# EAGLE board 6matrix (EAGLE 9.4.1), part 1 of 2
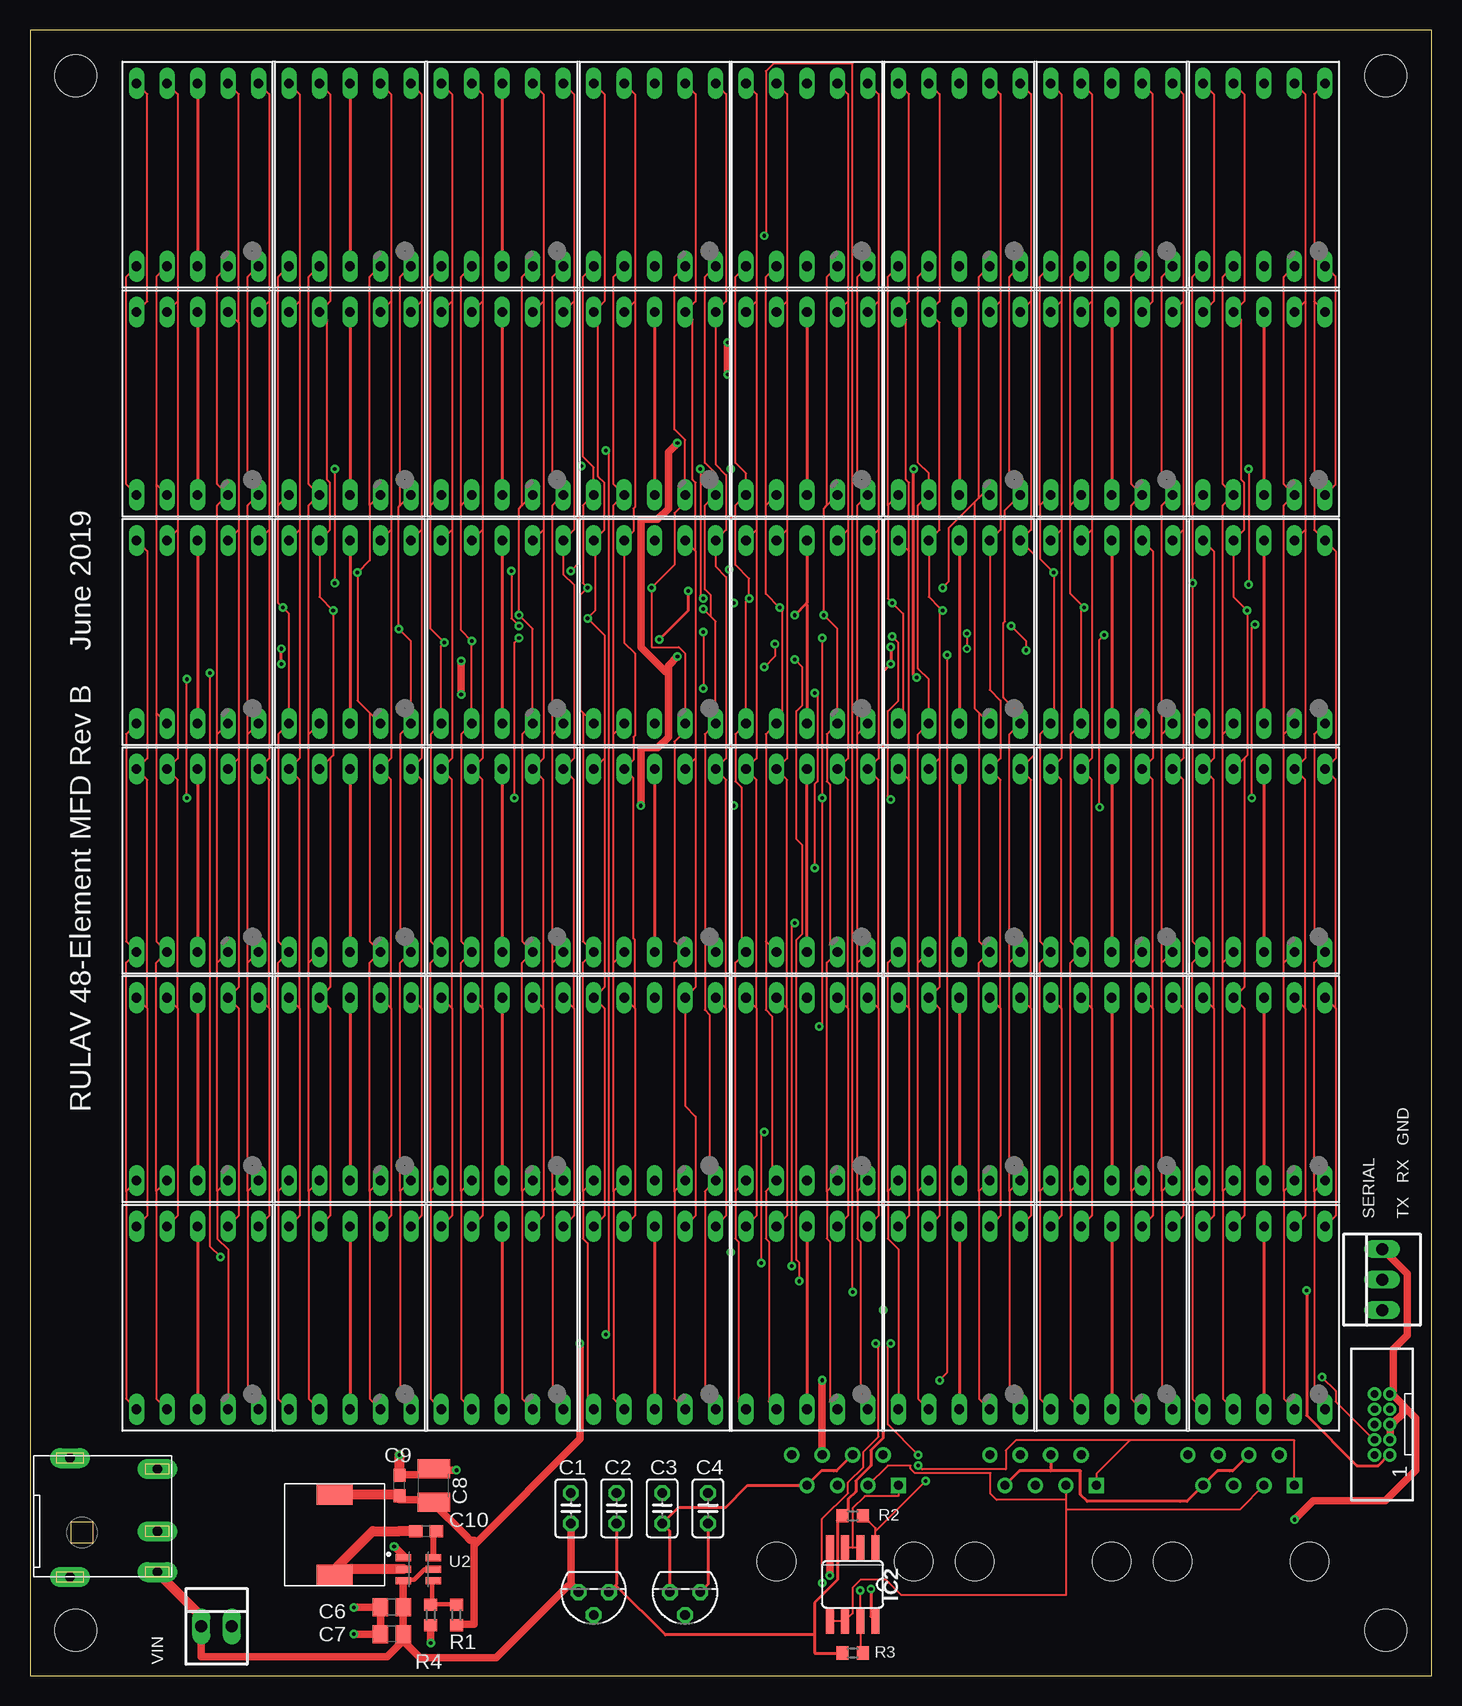
[diagram p4: board, top side]
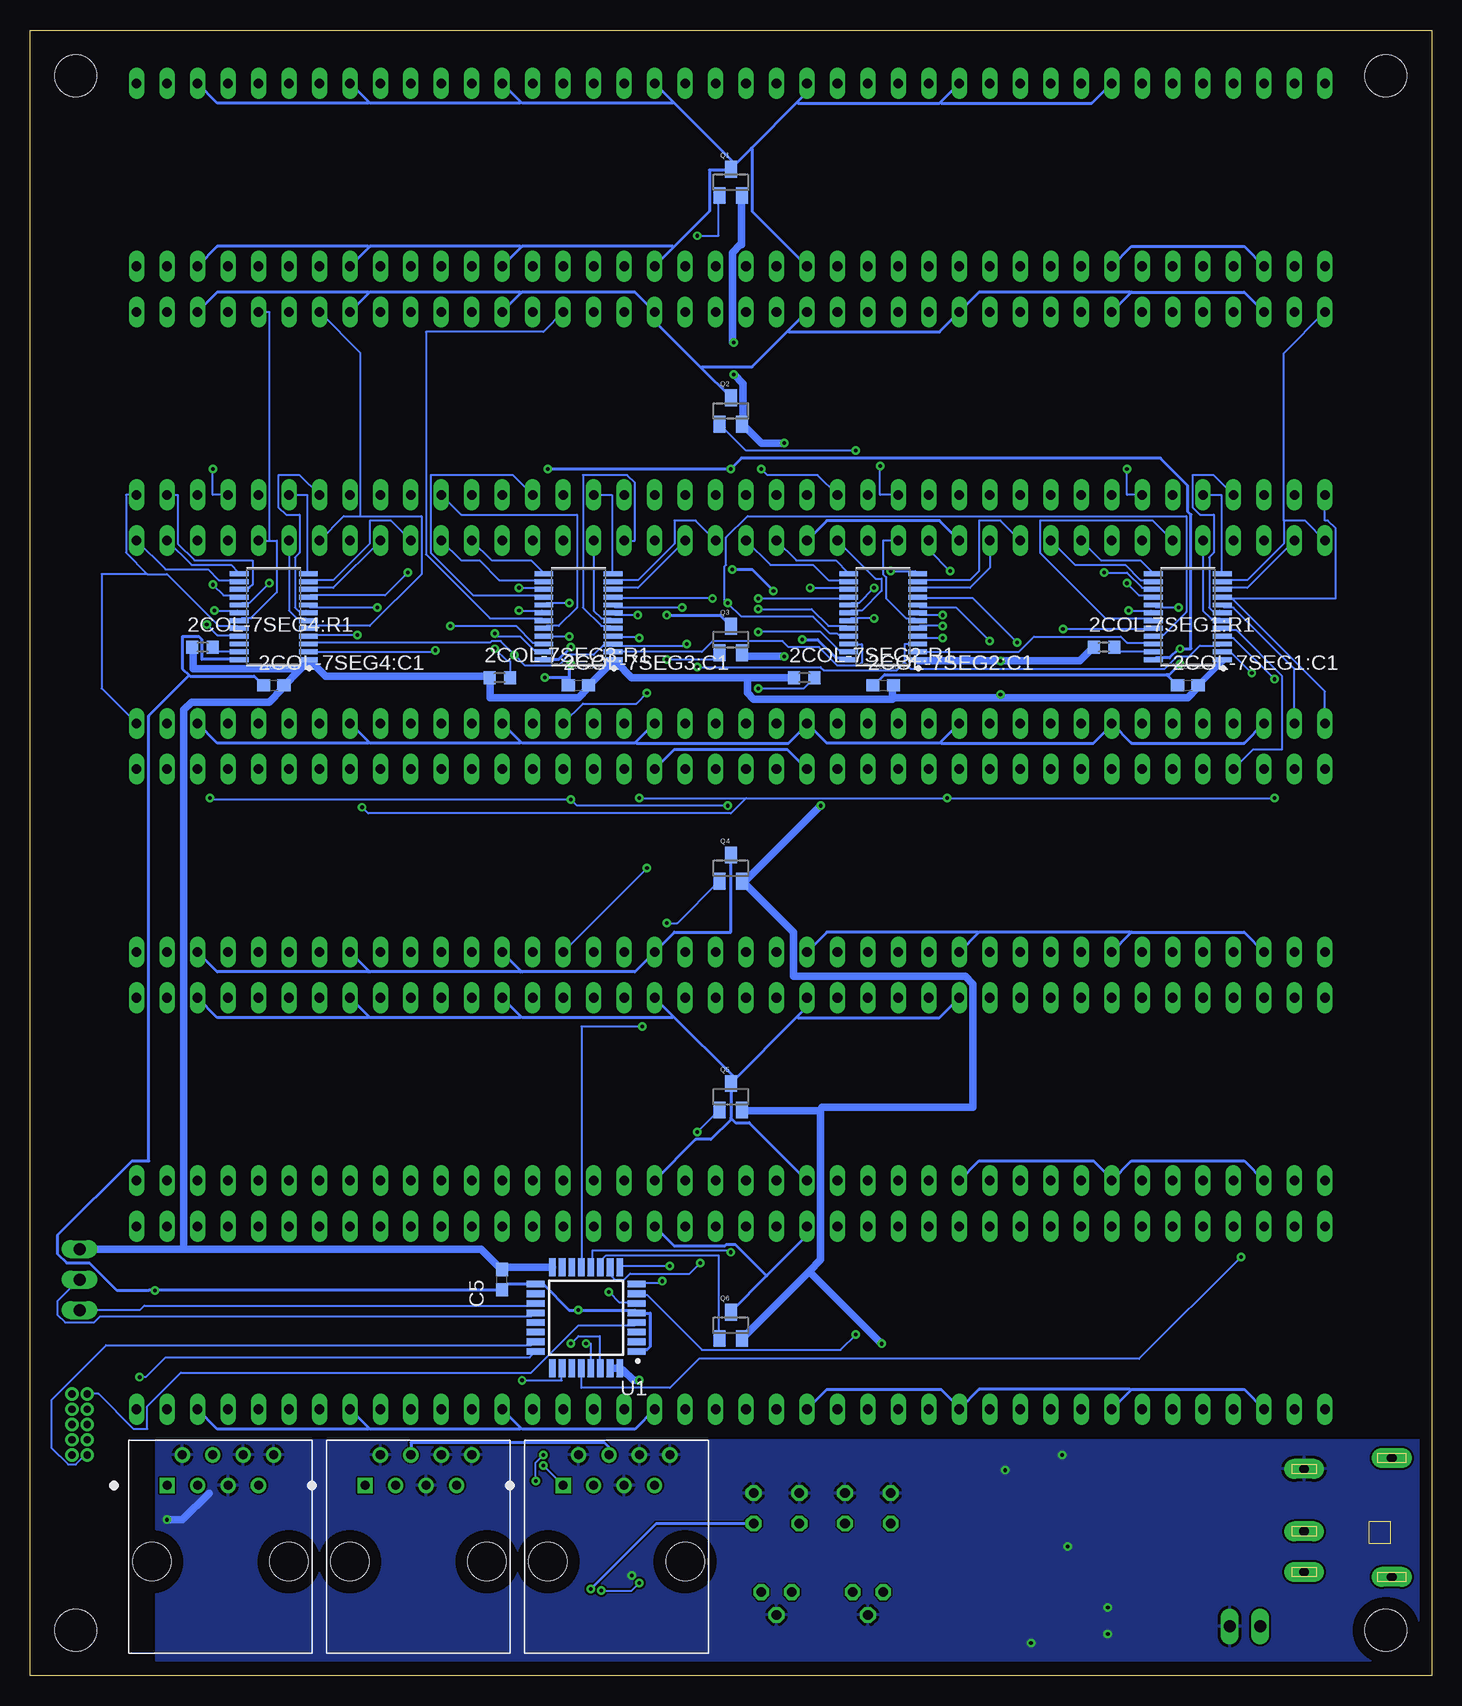
[diagram p5: board, bottom side, seen from below]

Size 116.84 x 137.16 mm. Coordinates in mm from the lower left corner, seen from the top.
Outline: 0,0 116.84,0 116.84,137.16 0,137.16 0,0
Copper layers (1*16): Top 0.035mm / dielectric 1.5mm / Bottom 0.035mm
Design rules "default *": minimum track width 6mil, minimum drill 0.3mm, track to track 6mil, track to pad 6mil, pad to pad 6mil, via to via 6mil, smd to smd 6mil, copper to edge 40mil, drill to drill 6mil, minimum pad ring 10mil, minimum via ring 8mil, stop-mask expansion 4mil, vias tented up to drill 13mil, thermal gap 10mil
Net classes: 0 default: width 0.152 mm, drill 0.152 mm, clearance 0.152 mm; 1 ledpower: width 0.635 mm, drill 0.305 mm, clearance 0.152 mm to class 0, clearance 0.152 mm; 2 icpower: width 0.254 mm, drill 0.203 mm, clearance 0.152 mm to class 0
Holes 3.5 mm at 3.81,3.81 113.03,3.81 3.81,133.35 113.03,133.35

## Footprints (pad centres in the part's own frame; a part is rotated, then mirrored left to right if it is on the bottom)
C0603 = smd 1.1 x 1: 1 -0.85,0; 2 0.85,0
SOP65P640X120-24 = smd 1.559 x 0.407: 1 -2.878,3.575; 2 -2.878,2.925; 3 -2.878,2.275; 4 -2.878,1.625; 5 -2.878,0.975; 6 -2.878,0.325; 7 -2.878,-0.325; 8 -2.878,-0.975; 9 -2.878,-1.625; 10 -2.878,-2.275; 11 -2.878,-2.925; 12 -2.878,-3.575; 13 2.878,-3.575; 14 2.878,-2.925; 15 2.878,-2.275; 16 2.878,-1.625; 17 2.878,-0.975; 18 2.878,-0.325; 19 2.878,0.325; 20 2.878,0.975; 21 2.878,1.625; 22 2.878,2.275; 23 2.878,2.925; 24 2.878,3.575
SA56-11 = drill 0.8 long: 1 -5.08,-7.62; 2 -2.54,-7.62; 3 0,-7.62; 4 2.54,-7.62; 5 5.08,-7.62; 6 5.08,7.62; 7 2.54,7.62; 8 0,7.62; 9 -2.54,7.62; 10 -5.08,7.62
R0603 = smd 1 x 1.1: 1 -0.85,0; 2 0.85,0
C025-025X050 = drill 0.813 octagon: 1 -1.27,0; 2 1.27,0
C0805 = smd 1.3 x 1.5: 1 -0.95,0; 2 0.95,0
C1210 = smd 1.6 x 2.7: 1 -1.4,0; 2 1.4,0
SO08 = smd 0.66 x 2.032: 1 -1.905,-3.073; 2 -0.635,-3.073; 3 0.635,-3.073; 4 1.905,-3.073; 5 1.905,3.073; 6 0.635,3.073; 7 -0.635,3.073; 8 -1.905,3.073
TO92 = drill 0.813 octagon: 1 -1.27,0; 2 0,1.905; 3 1.27,0
CORTEX_HEADER = drill 0.6 pad 1: 1 -2.54,-0.635; 2 -2.54,0.635; 3 -1.27,-0.635; 4 -1.27,0.635; 5 0,-0.635; 6 0,0.635; 7 1.27,-0.635; 8 1.27,0.635; 9 2.54,-0.635; 10 2.54,0.635
SOT23 = smd 1 x 1.4: 1 -0.95,-1.1; 2 0.95,-1.1; 3 0,1.1
22-23-2031 = drill 1 long: 1 -2.54,0; 2 0,0; 3 2.54,0
QFP80P900X900X160-32N = smd 1.5 x 0.55: 1 -4.2,2.8; 2 -4.2,2; 3 -4.2,1.2; 4 -4.2,0.4; 5 -4.2,-0.4; 6 -4.2,-1.2; 7 -4.2,-2; 8 -4.2,-2.8; 17 4.2,-2.8; 18 4.2,-2; 19 4.2,-1.2; 20 4.2,-0.4; 21 4.2,0.4; 22 4.2,1.2; 23 4.2,2; 24 4.2,2.8 | smd 0.55 x 1.5: 9 -2.8,-4.2; 10 -2,-4.2; 11 -1.2,-4.2; 12 -0.4,-4.2; 13 0.4,-4.2; 14 1.2,-4.2; 15 2,-4.2; 16 2.8,-4.2; 25 2.8,4.2; 26 2,4.2; 27 1.2,4.2; 28 0.4,4.2; 29 -0.4,4.2; 30 -1.2,4.2; 31 -2,4.2; 32 -2.8,4.2
SOT95P280X110-6N = smd 1.3 x 0.6: 1 -1.255,0.95; 2 -1.255,0; 3 -1.255,-0.95; 4 1.255,-0.95; 5 1.255,0; 6 1.255,0.95
AMPHENOL_54602-908LF = drill 0.76 square: 1 -4.445,6.35 | drill 0.76: 2 -3.175,8.89; 3 -1.905,6.35; 4 -0.635,8.89; 5 0.635,6.35; 6 1.905,8.89; 7 3.175,6.35; 8 4.445,8.89 | hole 3.2: -5.715,0; 5.715,0
DEM804XC = smd 1.75 x 3: P$1 -3.375,0; P$2 3.375,0
CUI-PJ-051 = drill 0.8 pad 1.676 long: P$1 10.3,0.4; P$2 10.3,9; P$3 10.3,3.8; P$G1 3,9.9; P$G2 3,0
22-23-2021 = drill 1 long: 1 -1.27,0; 2 1.27,0

## Placement (x,y rotation side)
2COL-7SEG1:C1  1uF  [C0603]  20.32,82.55 0 bottom
2COL-7SEG1:IC1  STP16CPC26XTR  [SOP65P640X120-24]  20.32,88.27 180 bottom
2COL-7SEG1:LED1  7-SEG_SA56-11  [SA56-11]  13.97,125.09 0 top
2COL-7SEG1:LED2  7-SEG_SA56-11  [SA56-11]  13.97,106.05 0 top
2COL-7SEG1:LED3  7-SEG_SA56-11  [SA56-11]  13.97,86.99 0 top
2COL-7SEG1:LED4  7-SEG_SA56-11  [SA56-11]  13.97,67.94 0 top
2COL-7SEG1:LED5  7-SEG_SA56-11  [SA56-11]  13.97,48.9 0 top
2COL-7SEG1:LED6  7-SEG_SA56-11  [SA56-11]  13.97,29.84 0 top
2COL-7SEG1:LED7  7-SEG_SA56-11  [SA56-11]  26.67,125.09 0 top
2COL-7SEG1:LED8  7-SEG_SA56-11  [SA56-11]  26.67,106.05 0 top
2COL-7SEG1:LED9  7-SEG_SA56-11  [SA56-11]  26.67,86.99 0 top
2COL-7SEG1:LED10  7-SEG_SA56-11  [SA56-11]  26.67,67.94 0 top
2COL-7SEG1:LED11  7-SEG_SA56-11  [SA56-11]  26.67,48.9 0 top
2COL-7SEG1:LED12  7-SEG_SA56-11  [SA56-11]  26.67,29.84 0 top
2COL-7SEG1:R1  [R0603]  27.3,85.72 0 bottom
2COL-7SEG2:C1  1uF  [C0603]  45.72,82.55 0 bottom
2COL-7SEG2:IC1  STP16CPC26XTR  [SOP65P640X120-24]  45.72,88.27 180 bottom
2COL-7SEG2:LED1  7-SEG_SA56-11  [SA56-11]  39.37,125.09 0 top
2COL-7SEG2:LED2  7-SEG_SA56-11  [SA56-11]  39.37,106.05 0 top
2COL-7SEG2:LED3  7-SEG_SA56-11  [SA56-11]  39.37,86.99 0 top
2COL-7SEG2:LED4  7-SEG_SA56-11  [SA56-11]  39.37,67.94 0 top
2COL-7SEG2:LED5  7-SEG_SA56-11  [SA56-11]  39.37,48.9 0 top
2COL-7SEG2:LED6  7-SEG_SA56-11  [SA56-11]  39.37,29.84 0 top
2COL-7SEG2:LED7  7-SEG_SA56-11  [SA56-11]  52.07,125.09 0 top
2COL-7SEG2:LED8  7-SEG_SA56-11  [SA56-11]  52.07,106.05 0 top
2COL-7SEG2:LED9  7-SEG_SA56-11  [SA56-11]  52.07,86.99 0 top
2COL-7SEG2:LED10  7-SEG_SA56-11  [SA56-11]  52.07,67.94 0 top
2COL-7SEG2:LED11  7-SEG_SA56-11  [SA56-11]  52.07,48.9 0 top
2COL-7SEG2:LED12  7-SEG_SA56-11  [SA56-11]  52.07,29.84 0 top
2COL-7SEG2:R1  [R0603]  52.29,83.19 0 bottom
2COL-7SEG3:C1  1uF  [C0603]  71.12,82.55 0 bottom
2COL-7SEG3:IC1  STP16CPC26XTR  [SOP65P640X120-24]  71.12,88.27 180 bottom
2COL-7SEG3:LED1  7-SEG_SA56-11  [SA56-11]  64.77,125.09 0 top
2COL-7SEG3:LED2  7-SEG_SA56-11  [SA56-11]  64.77,106.05 0 top
2COL-7SEG3:LED3  7-SEG_SA56-11  [SA56-11]  64.77,86.99 0 top
2COL-7SEG3:LED4  7-SEG_SA56-11  [SA56-11]  64.77,67.94 0 top
2COL-7SEG3:LED5  7-SEG_SA56-11  [SA56-11]  64.77,48.9 0 top
2COL-7SEG3:LED6  7-SEG_SA56-11  [SA56-11]  64.77,29.84 0 top
2COL-7SEG3:LED7  7-SEG_SA56-11  [SA56-11]  77.47,125.09 0 top
2COL-7SEG3:LED8  7-SEG_SA56-11  [SA56-11]  77.47,106.05 0 top
2COL-7SEG3:LED9  7-SEG_SA56-11  [SA56-11]  77.47,86.99 0 top
2COL-7SEG3:LED10  7-SEG_SA56-11  [SA56-11]  77.47,67.94 0 top
2COL-7SEG3:LED11  7-SEG_SA56-11  [SA56-11]  77.47,48.9 0 top
2COL-7SEG3:LED12  7-SEG_SA56-11  [SA56-11]  77.47,29.84 0 top
2COL-7SEG3:R1  [R0603]  77.69,83.19 0 bottom
2COL-7SEG4:C1  1uF  [C0603]  96.52,82.55 0 bottom
2COL-7SEG4:IC1  STP16CPC26XTR  [SOP65P640X120-24]  96.52,88.27 180 bottom
2COL-7SEG4:LED1  7-SEG_SA56-11  [SA56-11]  90.17,125.09 0 top
2COL-7SEG4:LED2  7-SEG_SA56-11  [SA56-11]  90.17,106.05 0 top
2COL-7SEG4:LED3  7-SEG_SA56-11  [SA56-11]  90.17,86.99 0 top
2COL-7SEG4:LED4  7-SEG_SA56-11  [SA56-11]  90.17,67.94 0 top
2COL-7SEG4:LED5  7-SEG_SA56-11  [SA56-11]  90.17,48.9 0 top
2COL-7SEG4:LED6  7-SEG_SA56-11  [SA56-11]  90.17,29.84 0 top
2COL-7SEG4:LED7  7-SEG_SA56-11  [SA56-11]  102.87,125.09 0 top
2COL-7SEG4:LED8  7-SEG_SA56-11  [SA56-11]  102.87,106.05 0 top
2COL-7SEG4:LED9  7-SEG_SA56-11  [SA56-11]  102.87,86.99 0 top
2COL-7SEG4:LED10  7-SEG_SA56-11  [SA56-11]  102.87,67.94 0 top
2COL-7SEG4:LED11  7-SEG_SA56-11  [SA56-11]  102.87,48.9 0 top
2COL-7SEG4:LED12  7-SEG_SA56-11  [SA56-11]  102.87,29.84 0 top
2COL-7SEG4:R1  [R0603]  102.45,85.72 0 bottom
C1  10uF  [C025-025X050]  45.09,13.97 90 top
C2  1uF  [C025-025X050]  48.9,13.97 90 top
C3  1uF  [C025-025X050]  52.71,13.97 90 top
C4  10uF  [C025-025X050]  56.52,13.97 90 top
C5  1uF  [C0603]  77.47,33.02 90 bottom
C6  10uF  [C0805]  30.16,5.71 180 top
C7  10uF  [C0805]  30.16,3.49 180 top
C8  47uF  [C1210]  33.66,15.88 90 top
C9  [C0603]  30.8,15.88 90 top
C10  0.1uF  [C0603]  33.02,12.06 0 top
IC2  PCA9600SO8  [SO08]  68.58,7.62 180 top
IC3  7803  [TO92]  46.99,6.98 180 top
IC4  7810  [TO92]  54.61,6.98 180 top
PROG  CORTEX_HEADERJ  [CORTEX_HEADER]  112.71,20.95 90 top
Q1  MOSFET-PCHANNEL  [SOT23]  58.42,124.46 0 bottom
Q2  MOSFET-PCHANNEL  [SOT23]  58.42,105.41 0 bottom
Q3  MOSFET-PCHANNEL  [SOT23]  58.42,86.36 0 bottom
Q4  MOSFET-PCHANNEL  [SOT23]  58.42,67.31 0 bottom
Q5  MOSFET-PCHANNEL  [SOT23]  58.42,48.26 0 bottom
Q6  MOSFET-PCHANNEL  [SOT23]  58.42,29.21 0 bottom
R1  22.6k  [R0603]  35.56,5.08 270 top
R2  2k  [R0603]  68.58,13.33 180 top
R3  2k  [R0603]  68.58,1.91 180 top
R4  10k  [R0603]  33.4,5.08 90 top
SERIAL  22-23-2031  [22-23-2031]  112.71,33.02 90 top
U1  STM32F303K8T6  [QFP80P900X900X160-32N]  70.48,29.84 180 bottom
U2  TPS563200  [SOT95P280X110-6N]  32.38,8.89 0 top
U$1  54602-908LF  [AMPHENOL_54602-908LF]  84.45,9.53 0 bottom
U$2  54602-908LF  [AMPHENOL_54602-908LF]  100.96,9.53 0 bottom
U$3  54602-908LF  [AMPHENOL_54602-908LF]  67.94,9.53 0 bottom
U$4  2.2uH  [DEM804XC]  25.4,11.75 90 top
U$5  CUI-PJ-051  [CUI-PJ-051]  0.32,8.26 0 top
VIN  22-23-2021  [22-23-2021]  15.56,4.13 0 top